# Altium project Robo Module Interface v1.PrjPcb
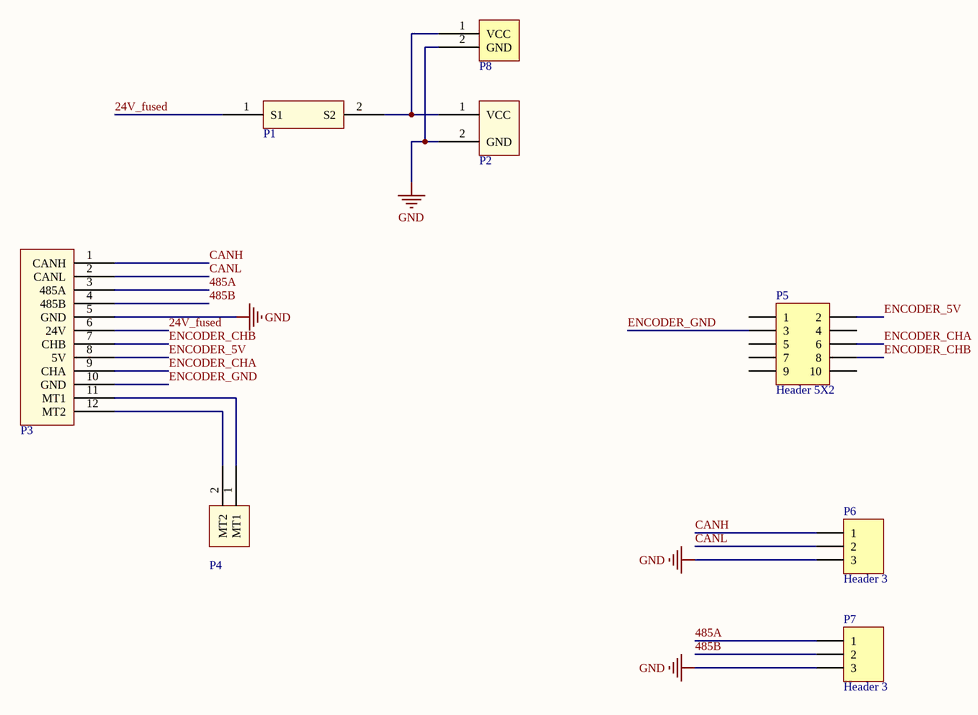
[diagram p0: connection.SchDoc]
1 sheet, 8 parts. Net scope: global (net labels, ports and power ports of the same name join across sheets).
Board file: Robo Module Interface v1.PcbDoc

## Sheet connection.SchDoc
size A4

### Parts
P1  Car Fuse  [car_fuse]  (value not drawn)
P2  big Pin power port  [bigPin_power_port]  (value not drawn)
P3  Robo Module Connector  [robomoduleConnector]  (value not drawn)
P4  KF762-p_connector  [KF762]  (value not drawn)
P5  Header 5X2  [HDR2X5]
P6  Header 3  [HDR1X3]
P7  Header 3  [HDR1X3]
P8  5557 Connector  [5557_connector]  (value not drawn)

### Nets
GND: P2.2(GND) P3.5(GND) P6.3 P7.3 P8.2(GND)
24V_fused: P1.1(S1) P3.6(24V)
485A: P3.3(485A) P7.1
485B: P3.4(485B) P7.2
CANH: P3.1(CANH) P6.1
CANL: P3.2(CANL) P6.2
ENCODER_5V: P3.8(5V) P5.2
ENCODER_CHA: P3.9(CHA) P5.6
ENCODER_CHB: P3.7(CHB) P5.8
ENCODER_GND: P3.10(GND) P5.3
NetP1_2: P1.2(S2) P2.1(VCC) P8.1(VCC)
NetP3_11: P3.11(MT1) P4.1(MT1)
NetP3_12: P3.12(MT2) P4.2(MT2)

Not connected (* = marked no-connect by the designer): P5 1 4 5 7 9 10

### Library data of the parts
P1 = Component_1
P3 = robomoduleConnector
P5 = Header 5X2: Header, 5-Pin, Dual row; LatestRevisionDate: 17-Jul-2002; LatestRevisionNote: Re-released for DXP Platform.; Publisher: Altium Limited
P6 P7 = Header 3: Header, 3-Pin; LatestRevisionDate: 17-Jul-2002; LatestRevisionNote: Re-released for DXP Platform.; Publisher: Altium Limited
P8 = 5557_connector